# Altium schematic sheet USB.SchDoc
size A4
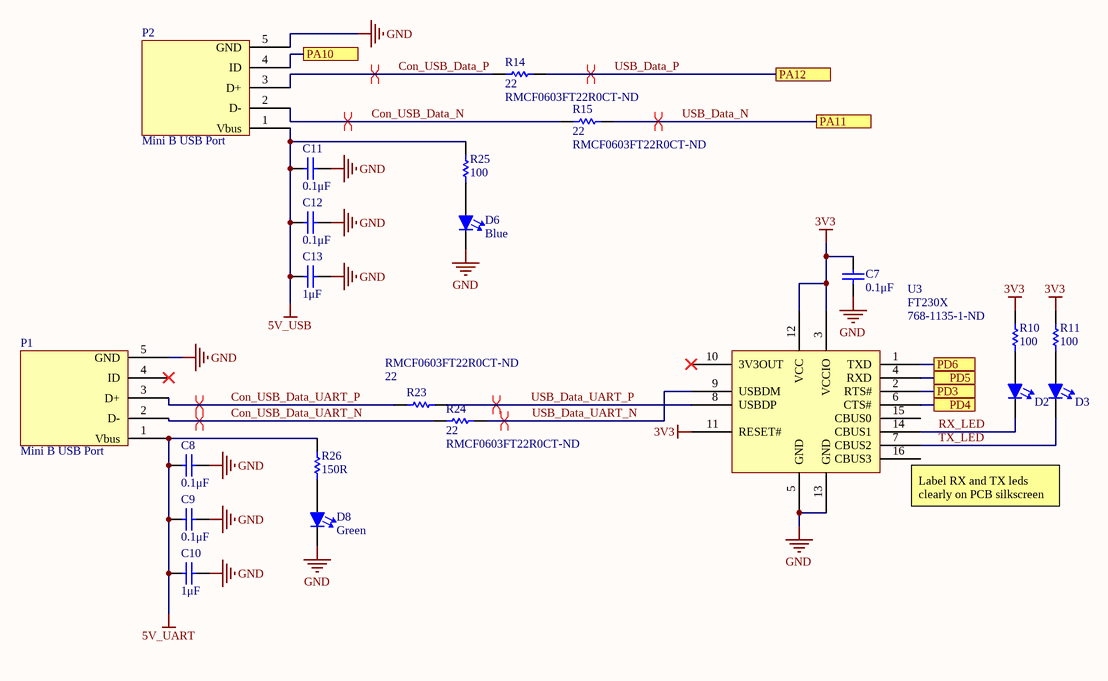
[diagram p0: USB.SchDoc]

## Parts
C7  0.1μF  [CAPC1608N(0603")]
C8  0.1μF  [CAPC1608N(0603")]
C9  0.1μF  [CAPC1608N(0603")]
C10  1μF  [CAPC1608N(0603")]
C11  0.1μF  [CAPC1608N(0603")]
C12  0.1μF  [CAPC1608N(0603")]
C13  1μF  [CAPC1608N(0603")]
D2  Red  [LED0805]  (value not drawn)
D3  Red  [LED0805]  (value not drawn)
D6  Blue  [LED0805]
D8  Green  [LED0805]
P1  Mini B USB Port  [Mini B USB Footprint]
P2  Mini B USB Port  [Mini B USB Footprint]
R10  100  [RESC1608N(0603")]
R11  100  [RESC1608N(0603")]
R14  22  Supplier Part Number 1: RMCF0603FT22R0CT-ND  [RESC1608N(0603")]
R15  22  Supplier Part Number 1: RMCF0603FT22R0CT-ND  [RESC1608N(0603")]
R23  22  Supplier Part Number 1: RMCF0603FT22R0CT-ND  [RESC1608N(0603")]
R24  22  Supplier Part Number 1: RMCF0603FT22R0CT-ND  [RESC1608N(0603")]
R25  100  [RESC1608N(0603")]
R26  150R  [RESC1608N(0603")]
U3  FT230X  Supplier Part Number 1: 768-1135-1-ND  [SSOP16]

## Ports
PA10, PA11, PA12, PD3, PD4, PD5, PD6

## Nets
3V3: C7.2(Cathode) R10.2 R11.2 U3.3(VCCIO) U3.11(RESET#) U3.12(VCC)
5V_UART: C8.2(Cathode) C9.2(Cathode) C10.2(Cathode) P1.1(Vbus) R26.2
5V_USB: C11.2(Cathode) C12.2(Cathode) C13.2(Cathode) P2.1(Vbus) R25.2
GND: C7.1(Anode) C8.1(Anode) C9.1(Anode) C10.1(Anode) C11.1(Anode) C12.1(Anode) C13.1(Anode) D6.1(Cathode) D8.1(Cathode) P1.5(GND) P2.5(GND) U3.5(GND) U3.13(GND)
Con_USB_Data_N: P2.2(D-) R15.1
Con_USB_Data_P: P2.3(D+) R14.1
Con_USB_Data_UART_N: P1.2(D-) R24.1
Con_USB_Data_UART_P: P1.3(D+) R23.1
PA10: P2.4(ID) ; port PA10
PD3: U3.2(RTS#) ; port PD3
PD4: U3.6(CTS#) ; port PD4
PD5: U3.4(RXD) ; port PD5
PD6: U3.1(TXD) ; port PD6
RX_LED: D2.1(Cathode) U3.14(CBUS1)
TX_LED: D3.1(Cathode) U3.7(CBUS2)
USB_Data_N: R15.2 ; port PA11
USB_Data_P: R14.2 ; port PA12
USB_Data_UART_N: R24.2 U3.9(USBDM)
USB_Data_UART_P: R23.2 U3.8(USBDP)
NetD2_2: D2.2(Anode) R10.1
NetD3_2: D3.2(Anode) R11.1
NetD6_2: D6.2(Anode) R25.1
NetD8_2: D8.2(Anode) R26.1

Not connected (* = marked no-connect by the designer): P1 4(ID)*; U3 10(3V3OUT)* 15(CBUS0) 16(CBUS3)

## Layout directives
differential pair: Con_USB_Data_N, Con_USB_Data_P, Con_USB_Data_UART_N, Con_USB_Data_UART_P, USB_Data_N, USB_Data_P, USB_Data_UART_N, USB_Data_UART_P

## Notes on the sheet
- (near U3) Label RX and TX leds clearly on PCB silkscreen

## Library data of the parts
C7-C9 C11 C12 = 0.1uF 100V 0603 SMD, Ceramic: Capacitor, Ceramic, 100V, +/- 10%, 0603 SMD, X7R; MFG: TDK; MFG#: CGA3E3X7S2A104K080AB; Published: 16-04-26; Publisher: AUVic; PackageDescription: Chip Capacitor; Value: 0.1μF; Created By: Ashwin Sira; Supplier 1: Digi-Key; Supplier Part Number 1: 445-6938-1-ND
C10 C13 = 1uF 25V 0603 SMD, Ceramic: Capacitor, Ceramic, 25V, +/- 10%, 0603 SMD, X5R; MFG: Murata-Electronics-North-America; MFG#: GRM188R61E105KA12D; Published: 16-06-27; Publisher: AUVic; PackageDescription: Chip Capacitor; Value: 1μF; Created By: Andy Bates; Supplier 1: Digi-Key; Supplier Part Number 1: 490-3897-1-ND
D2 D3 = LED, 0805 (2012), Red, Clear: Supplier 1: Digi-Key; Supplier Part Number 1: 732-4984-1-ND; Colour: Red; Created By: Ashwin Sira
D6 = LED, 0805 (2012), Blue, Clear: Colour: Red; Created By: Ashwin Sira; Supplier 1: Digi-Key; Supplier Part Number 1: 732-4982-1-ND
D8 = LED, 0805 (2012), Green, Clear: Colour: Green; Created By: Andy Bates; Supplier 1: Digi-Key; Supplier Part Number 1: 475-1410-1-ND
P1 P2 = Mini B USB Port: Mini B USB Port - Female; Created by: Gabriel Green; Created on: July 5, 2017; Supplier 1: Digi-Key; Supplier Part Number 1: 151-1206-1-ND
R10 R11 R25 = 100R, 1%, 1/10W, 0603 SMD: Made By: Andy Bates; Owned By: AUVic; Created On: 16-09-10; Last Edited: 16-09-10; Value: 100; Supplier 1: Digi-Key; Supplier Part Number 1: 311-100HRCT-ND
R14 R15 R23 R24 = 22 Ohm, 1%, 1/10W , 0603, SMD: Created By: Robert Keen; Publisher: AUVic; Date Created: 2018-07-17; Value: 22; ComponentLink1Description: Digikey; ComponentLink1URL: https://www.digikey.ca/product-detail/en/stackpole-electronics-inc/RMCF0603FT22R0/RMCF0603FT22R0CT-ND/1942946; Supplier 1: Digi-Key
R26 = 150R, 1%, 1/10W, 0603, SMD: RES SMD 150 OHM 1% 1/10W 0603; Created By: Robert Keen; Publisher: AUVic; Date Created: 2018-08-15; Value: 150R; Supplier 1: Digi-Key; Supplier Part Number 1: P150HCT-ND; ComponentLink1Description: Digikey; ComponentLink1URL: https://www.digikey.ca/product-detail/en/panasonic-electronic-components/ERJ-3EKF1500V/P150HCT-ND/198177
U3 = FTDI - USB to UART: Supplier 1: Digi-Key; Created by: Gabriel Green; Created on: July 5th, 2017